# Altium project LPCXpresso55SXX.PrjPcb (part 2 of 2)

## Sheet CODEC.SchDoc
size A3; CheckedBy: José Ogando; Engineer: Eduardo Teofilo; Revision: A2; SheetNumber: 6; SheetTotal: 8
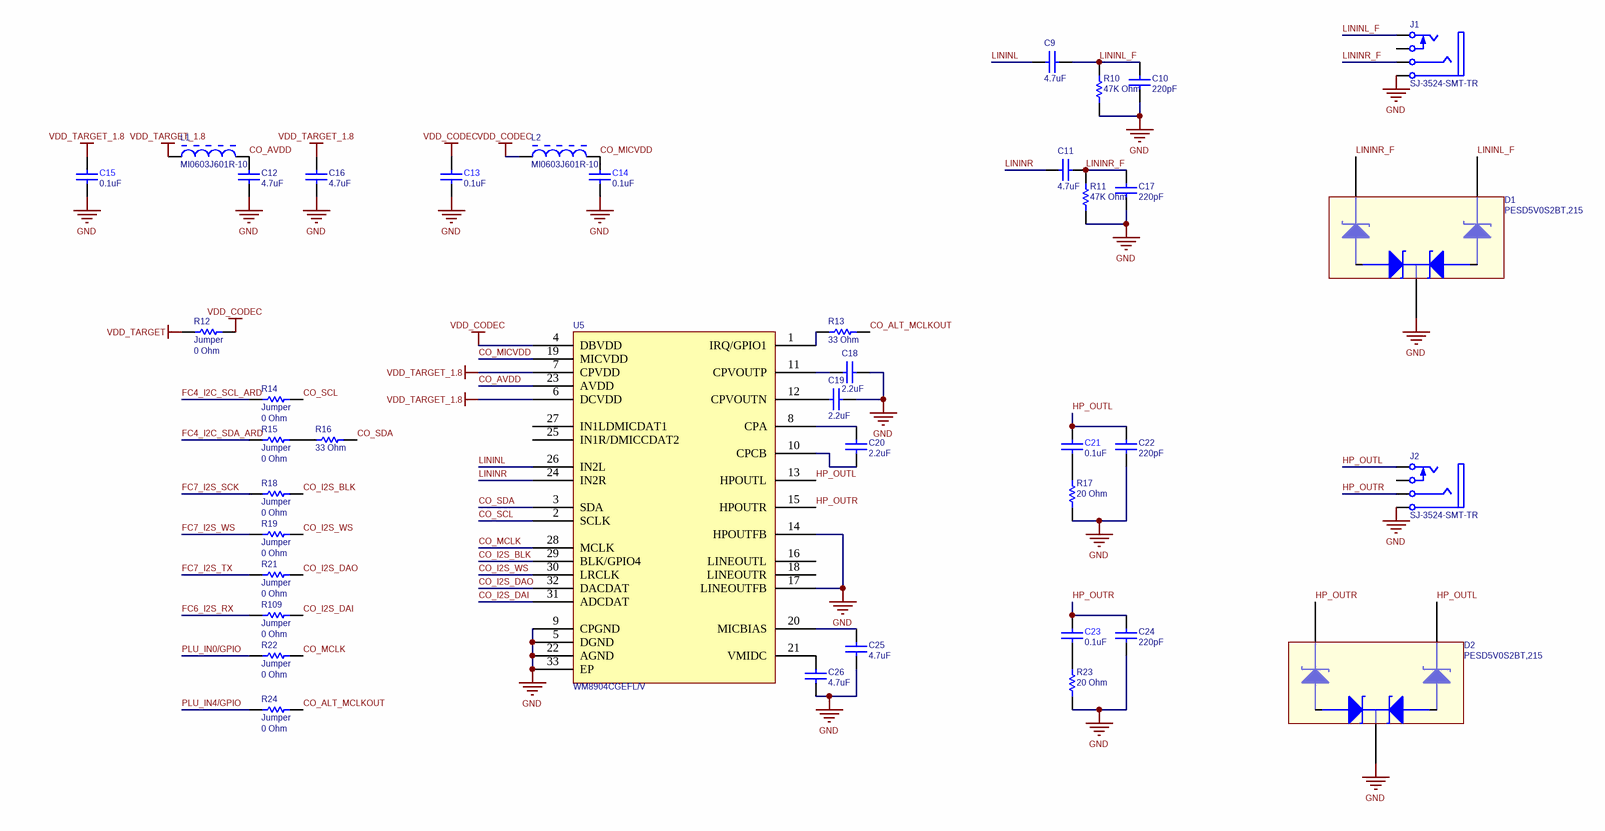
[diagram p5: CODEC.SchDoc]

### Parts
C9  value 4.7uF  [CAPC0603(1608)100_L]  (hidden comment: CAP 4.7uF 10V 0603(1608))
C10  value 220pF  [CAPC0402(1005)60_L]  (hidden comment: CAP 220pF 50V 0402(1005))
C11  value 4.7uF  [CAPC0603(1608)100_L]  (hidden comment: CAP 4.7uF 10V 0603(1608))
C12  value 4.7uF  [CAPC0603(1608)100_L]  (hidden comment: CAP 4.7uF 10V 0603(1608))
C13  value 0.1uF  [CAPC1005]  (hidden comment: CC0402KRX7R7BB104)
C14  value 0.1uF  [CAPC1005]  (hidden comment: CC0402KRX7R7BB104)
C15  value 0.1uF  [CAPC1005]  (hidden comment: CC0402KRX7R7BB104)
C16  value 4.7uF  [CAPC0603(1608)100_L]  (hidden comment: CAP 4.7uF 10V 0603(1608))
C17  value 220pF  [CAPC0402(1005)60_L]  (hidden comment: CAP 220pF 50V 0402(1005))
C18  value 2.2uF  [CAPC0402(1005)60_L]  (hidden comment: CAP 2.2uF 10V 0402(1005))
C19  value 2.2uF  [CAPC0402(1005)60_L]  (hidden comment: CAP 2.2uF 10V 0402(1005))
C20  value 2.2uF  [CAPC0402(1005)60_L]  (hidden comment: CAP 2.2uF 10V 0402(1005))
C21  value 0.1uF  [CAPC1005]  (hidden comment: CC0402KRX7R7BB104)
C22  value 220pF  [CAPC0402(1005)60_L]  (hidden comment: CAP 220pF 50V 0402(1005))
C23  value 0.1uF  [CAPC1005]  (hidden comment: CC0402KRX7R7BB104)
C24  value 220pF  [CAPC0402(1005)60_L]  (hidden comment: CAP 220pF 50V 0402(1005))
C25  value 4.7uF  [CAPC0603(1608)100_L]  (hidden comment: CAP 4.7uF 10V 0603(1608))
C26  value 4.7uF  [CAPC0603(1608)100_L]  (hidden comment: CAP 4.7uF 10V 0603(1608))
D1  PESD5V0S2BT,215  [SOT23-3]
D2  PESD5V0S2BT,215  [SOT23-3]
J1  SJ-3524-SMT-TR  [SJ-3524-SMT-TR]
J2  SJ-3524-SMT-TR  [SJ-3524-SMT-TR]
L1  MI0603J601R-10  [LIRD-MI0603J601R-10_V]
L2  MI0603J601R-10  [LIRD-MI0603J601R-10_V]
R10  value 47K Ohm  [RESC0402(1005)_L]  (hidden comment: 47K 1% 0402(1005))
R11  value 47K Ohm  [RESC0402(1005)_L]  (hidden comment: 47K 1% 0402(1005))
R12  Jumper  value 0 Ohm  [RESC0402(1005)_L]
R13  value 33 Ohm  [RESC0402(1005)_L]  (hidden comment: 33R 1% 0402(1005))
R14  Jumper  value 0 Ohm  [RESC0402(1005)_L]
R15  Jumper  value 0 Ohm  [RESC0402(1005)_L]
R16  value 33 Ohm  [RESC0402(1005)_L]  (hidden comment: 33R 1% 0402(1005))
R17  value 20 Ohm  [RESC0402(1005)_L]  (hidden comment: 20R 1% 0402(1005))
R18  Jumper  value 0 Ohm  [RESC0402(1005)_L]
R19  Jumper  value 0 Ohm  [RESC0402(1005)_L]
R21  Jumper  value 0 Ohm  [RESC0402(1005)_L]
R22  Jumper  value 0 Ohm  [RESC0402(1005)_L]
R23  value 20 Ohm  [RESC0402(1005)_L]  (hidden comment: 20R 1% 0402(1005))
R24  Jumper  value 0 Ohm  [RESC0402(1005)_L]
R109  Jumper  value 0 Ohm  [RESC0402(1005)_L]
U5  WM8904CGEFL/V  [QFN-32 4x4x0.75]

### Nets
GND: C10.1 C12.1 C13.2 C14.2 C15.2 C16.1 C17.1 C18.1 C19.1 C22.1 C24.1 C25.1 C26.1 D1.3(DK) D2.3(DK) J1.1(Sleeve) J2.1(Sleeve) R10.1 R11.1 R17.1 R23.1 U5.5(DGND) U5.9(CPGND) U5.14(HPOUTFB) U5.17(LINEOUTFB) U5.22(AGND) U5.33(EP)
VDD_CODEC: C13.1 L2.1 R12.1 U5.4(DBVDD)
VDD_TARGET: R12.2
VDD_TARGET_1.8: C15.1 C16.2 L1.1 U5.6(DCVDD) U5.7(CPVDD)
CO_ALT_MCLKOUT: R13.2 R24.1
CO_AVDD: C12.2 L1.2 U5.23(AVDD)
CO_I2S_BLK: R18.1 U5.29(BLK/GPIO4)
CO_I2S_DAI: R109.1 U5.31(ADCDAT)
CO_I2S_DAO: R21.1 U5.32(DACDAT)
CO_I2S_WS: R19.1 U5.30(LRCLK)
CO_MCLK: R22.1 U5.28(MCLK)
CO_MICVDD: C14.1 L2.2 U5.19(MICVDD)
CO_SCL: R14.1 U5.2(SCLK)
CO_SDA: R16.2 U5.3(SDA)
FC4_I2C_SCL_ARD: R14.2
FC4_I2C_SDA_ARD: R15.2
FC6_I2S_RX: R109.2
FC7_I2S_SCK: R18.2
FC7_I2S_TX: R21.2
FC7_I2S_WS: R19.2
HP_OUTL: C21.1 C22.2 D2.1(K1) J2.2(Tip) U5.13(HPOUTL)
HP_OUTR: C23.1 C24.2 D2.2(K2) J2.3(Ring) U5.15(HPOUTR)
LININL: C9.2 U5.26(IN2L)
LININL_F: C9.1 C10.2 D1.1(K1) J1.2(Tip) R10.2
LININR: C11.2 U5.24(IN2R)
LININR_F: C11.1 C17.2 D1.2(K2) J1.3(Ring) R11.2
PLU_IN0/GPIO: R22.2
PLU_IN4/GPIO: R24.2
NetC18_2: C18.2 U5.11(CPVOUTP)
NetC19_2: C19.2 U5.12(CPVOUTN)
NetC20_1: C20.1 U5.10(CPCB)
NetC20_2: C20.2 U5.8(CPA)
NetC21_2: C21.2 R17.2
NetC23_2: C23.2 R23.2
NetC25_2: C25.2 U5.20(MICBIAS)
NetC26_2: C26.2 U5.21(VMIDC)
NetR13_1: R13.1 U5.1(IRQ/GPIO1)
NetR15_1: R15.1 R16.1

Not connected (* = marked no-connect by the designer): J1 0 4(Tip_Switch); J2 0 4(Tip_Switch); U5 16(LINEOUTL) 18(LINEOUTR) 25(IN1R/DMICCDAT2) 27(IN1LDMICDAT1)

### Notes on the sheet
- Project:
- Sheet:
- Revision:
- Date:
- Size:
- Sheet number:
- Engineer
- Checked by:
- A3
- of
- www.code-ing.com

### Library data of the parts
C9 C11 C12 C16 C25 C26 = CMP-1035-02785-1: as C68 on sheet LPCXpresso55SXX_POWER-USB; Max Thickness: 1 mm; Technology: SMT; Rated Voltage: 10 V
C10 C17 C22 C24 = CMP-1034-01367-1: CAP 220pF 50V ±1% 0402 (1005 Metric) Thickness 0.6mm SMD; Tolerance: Â±1%; Case-EIA: 0402; Case-Metric: 1005; Max Thickness: 0.6 mm; Technology: SMT; Rated Voltage: 50 V
C13-C15 C21 C23 = CMP-0001-00074-1: as C71 on sheet LPCXpresso55SXX_POWER-USB; ClassName: Board Template Device; Rated Voltage: 16 V; Status: Production; Tolerance: 10 %; Mounting Technology: Surface Mount; Technology: Ceramic; Category: Capacitor; Dielectric: X7R; Publisher: Altium
C18-C20 = CMP-1034-02127-1: CAP 2.2uF 10V ±10% 0402 (1005 Metric) Thickness 0.6mm SMD; Case-EIA: 0402; Tolerance: Â±10%; Case-Metric: 1005; Technology: SMT; Rated Voltage: 10 V; Max Thickness: 0.6 mm
D1 D2 = PESD5V0S2BT,215: TVS DIODE 5V 14V SOT23; Manufacturer: Nexperia USA Inc.; Manufacturer part #: PESD5V0S2BT,215; Indications: *; Created by: eteofilo; Creation date: 17-Apr-2018; Value: *; Modified by: *
J1 J2 = SJ-3524-SMT-TR: CONN AUDIO JACK 3.5MM STEREO SMD; Manufacturer: CUI Inc; Manufacturer part#: SJ-3524-SMT-TR; Indications: *; Created by: gmoreno; Creation date: 23-May-2013; Modified by: *; Value: *
L1 L2 = CMP-2000-06700-1: as L8 on sheet LPCXpresso55SXX_POWER-USB; Datasheet Version: Rev. C, 08/2013; Ratings: -; Package Description: 2-Pin Surface Mount Device, Body 1.6 x 0.8 mm; Operating Temperature: -40°C~125°C; Category: Filters; Mounting Type: SurfaceMount; Size / Dimension: 0.063"Lx0.031"W(1.60mmx0.80mm); Family: FerriteBeadsandChips; Package Reference: MI00603J601R-10; Manufacturer URL: https://www.lairdtech.com/; Height (Max): 0.037"(0.95mm); Series: MI; Packaging: CutTape(CT); Mounting Technology: SurfaceMount; Package / Case: 0603(1608Metric); Standard Package: 1; Datasheet URL: http://cdn.lairdtech.com/home/brandworld/files/MI0603J601R-10.pdf
R10 R11 = CMP-1011-00699-1: 47K 0.063W 1% 0402 (1005 Metric)  SMD; Case-EIA: 0402; Case-Metric: 1005; Power: 0.063 W; Technology: SMT; Tolerance: 1 %
R12 R14 R15 R18 R19 R21 R22 R24 R109 = CMP-1011-00001-1: as R97 on sheet SHIELD-uSD-MIKROE-PMOD; Power: None; Technology: SMT
R13 R16 = CMP-1011-00341-1: 33R 0.063W 1% 0402 (1005 Metric)  SMD; Case-Metric: 1005; Case-EIA: 0402; Tolerance: 1 %; Power: 0.063 W; Technology: SMT
R17 R23 = CMP-1011-00316-1: 20R 0.063W 1% 0402 (1005 Metric)  SMD; Case-EIA: 0402; Case-Metric: 1005; Power: 0.063 W; Tolerance: 1 %; Technology: SMT
U5 = WM8904CGEFL/V: IC CODEC STEREO ULP 32QFN; Manufacturer: Cirrus Logic Inc.; Manufacturer part #: WM8904CGEFL/V; Indications: *; Created by: eteofilo; Creation date: 17-Apr-2018; Modified by: *; Value: *

## Sheet LINK2_LPC4322 PERIPH-DEBUG.SchDoc
size A3; CheckedBy: José Ogando; Engineer: Eduardo Teofilo; Revision: A2; SheetNumber: 8; SheetTotal: 8
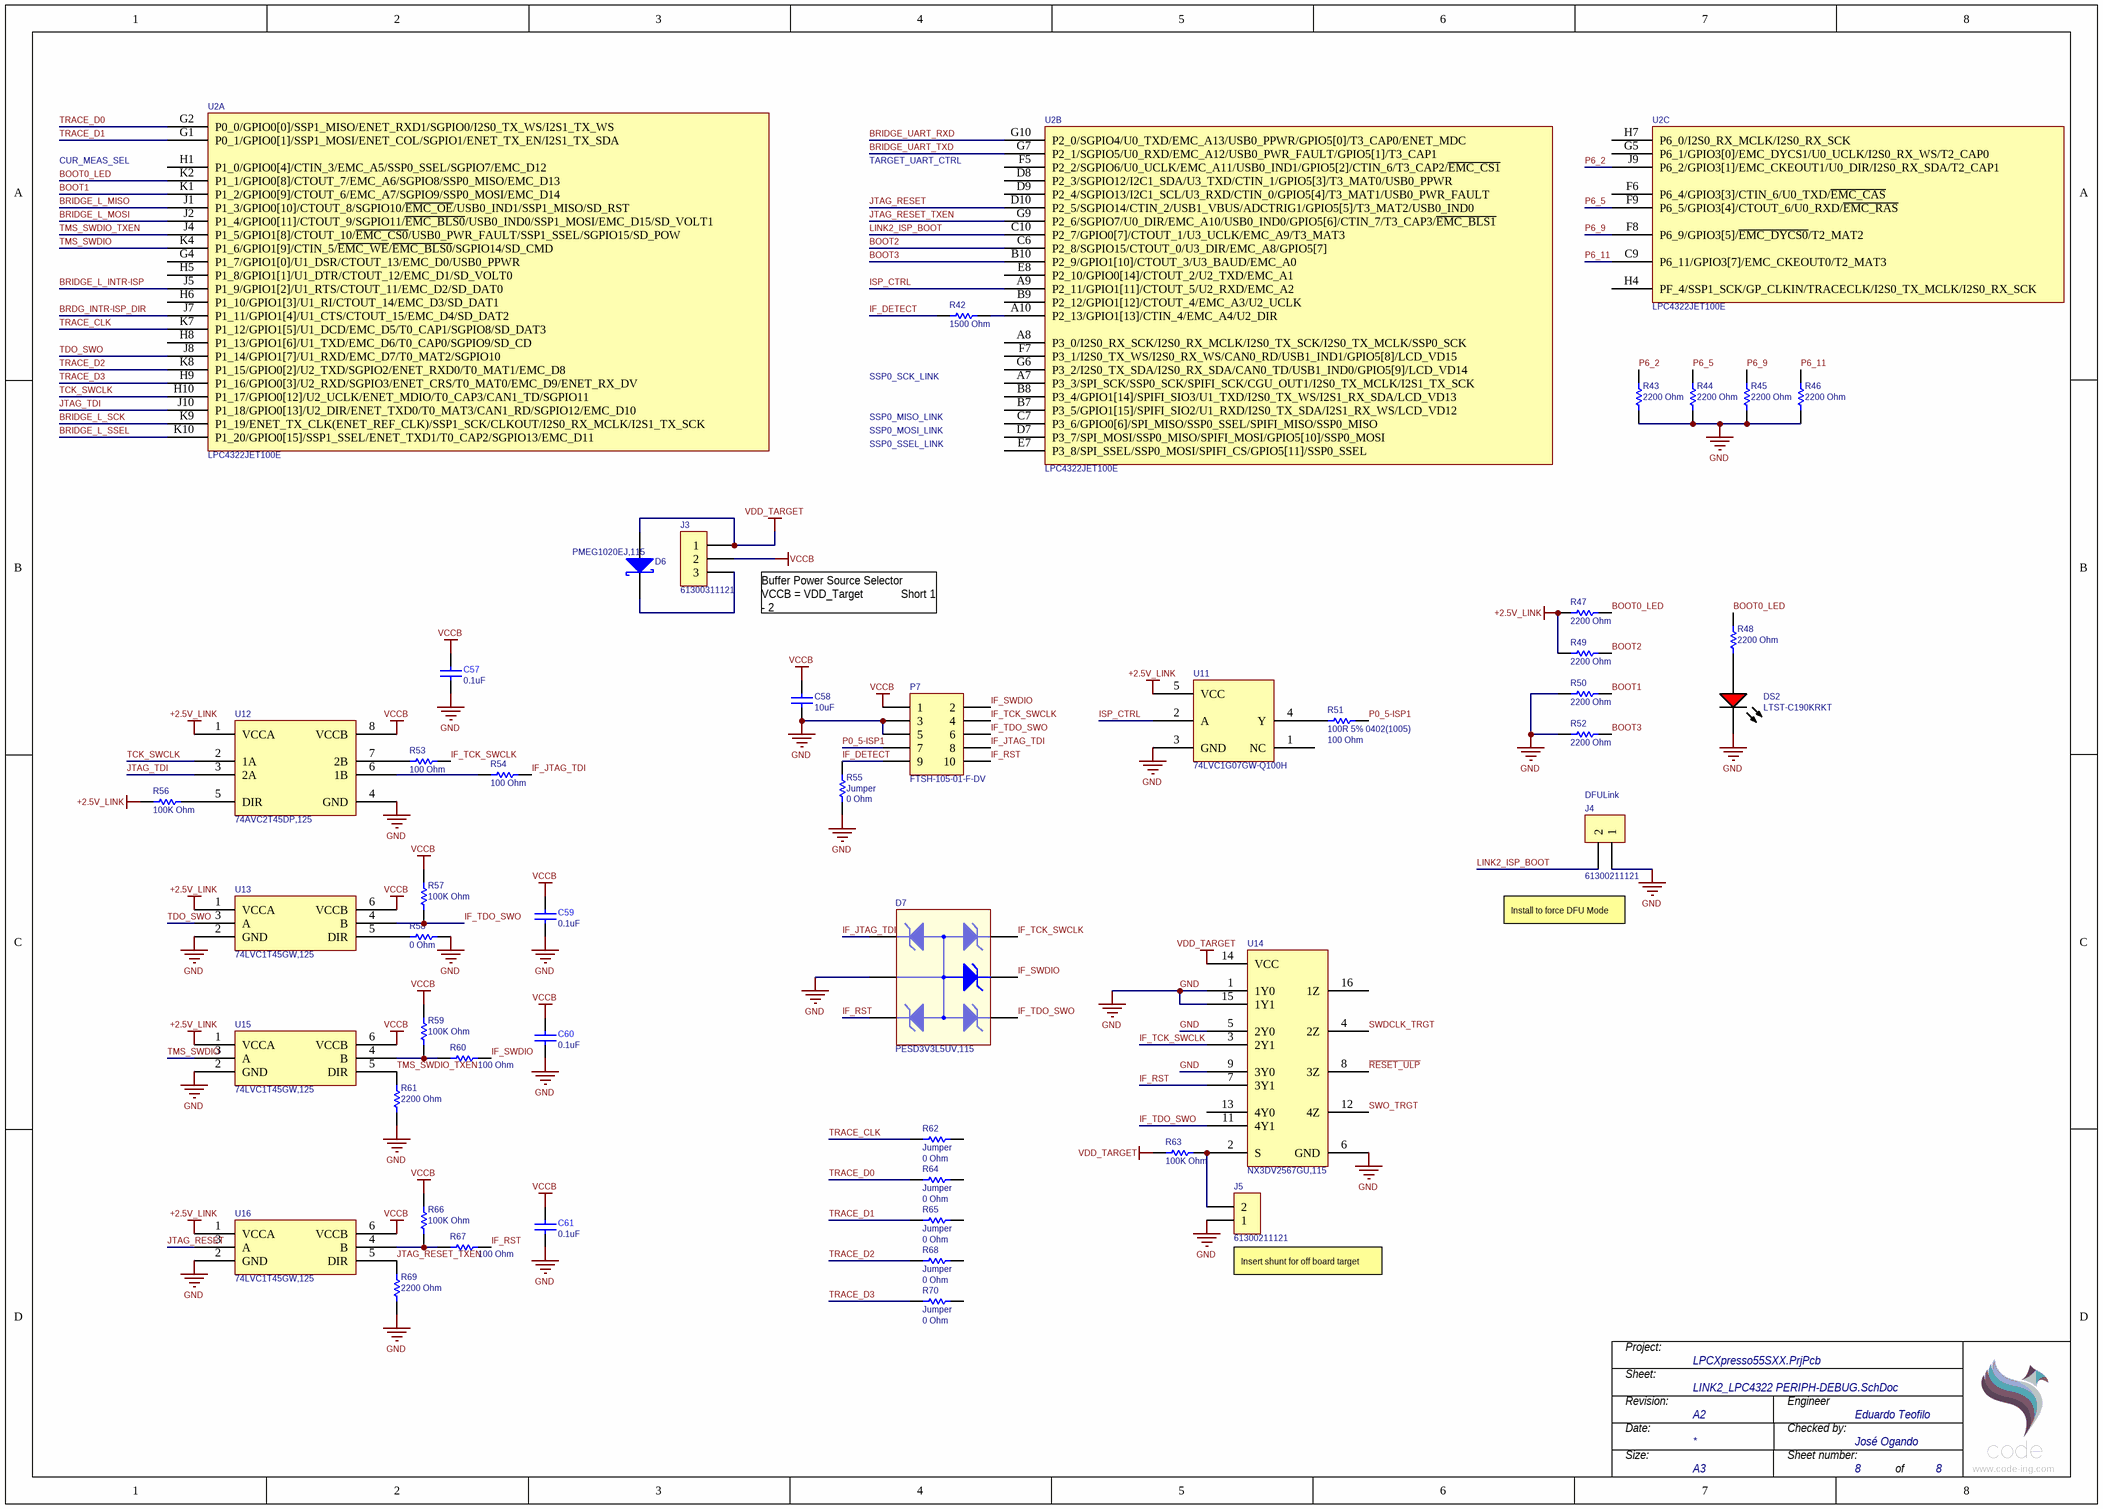
[diagram p6: LINK2_LPC4322 PERIPH-DEBUG.SchDoc]

### Parts
C57  value 0.1uF  [CAPC1005]  (hidden comment: CC0402KRX7R7BB104)
C58  value 10uF  [CAPC0805(2012)145_L]  (hidden comment: CAP 10uF 10V 0805(2012))
C59  value 0.1uF  [CAPC1005]  (hidden comment: CC0402KRX7R7BB104)
C60  value 0.1uF  [CAPC1005]  (hidden comment: CC0402KRX7R7BB104)
C61  value 0.1uF  [CAPC1005]  (hidden comment: CC0402KRX7R7BB104)
D6  PMEG1020EJ,115  [SOD-323F, SC90]
D7  PESD3V3L5UV,115  [SOT-666]
DS2  LTST-C190KRKT  [LTST-C191KRKT_V]
J3  61300311121  [61300311121]
J4  61300211121  [61300211121]
J5  61300211121  [61300211121]
P7  FTSH-105-01-F-DV  [FTSH-105-01-L-DV-K]
R42  value 1500 Ohm  [RESC0402(1005)_L]  (hidden comment: 1K5 1% 0402(1005))
R43  value 2200 Ohm  [RESC0402(1005)_L]  (hidden comment: 2K2 1% 0402(1005))
R44  value 2200 Ohm  [RESC0402(1005)_L]  (hidden comment: 2K2 1% 0402(1005))
R45  value 2200 Ohm  [RESC0402(1005)_L]  (hidden comment: 2K2 1% 0402(1005))
R46  value 2200 Ohm  [RESC0402(1005)_L]  (hidden comment: 2K2 1% 0402(1005))
R47  value 2200 Ohm  [RESC0402(1005)_L]  (hidden comment: 2K2 1% 0402(1005))
R48  value 2200 Ohm  [RESC0402(1005)_L]  (hidden comment: 2K2 1% 0402(1005))
R49  value 2200 Ohm  [RESC0402(1005)_L]  (hidden comment: 2K2 1% 0402(1005))
R50  value 2200 Ohm  [RESC0402(1005)_L]  (hidden comment: 2K2 1% 0402(1005))
R51  100R 5% 0402(1005)  value 100 Ohm  [RESC0402(1005)_L]
R52  value 2200 Ohm  [RESC0402(1005)_L]  (hidden comment: 2K2 1% 0402(1005))
R53  value 100 Ohm  [RESC0402(1005)_L]  (hidden comment: 100R 5% 0402(1005))
R54  value 100 Ohm  [RESC0402(1005)_L]  (hidden comment: 100R 5% 0402(1005))
R55  Jumper  value 0 Ohm  [RESC0402(1005)_L]
R56  value 100K Ohm  [RESC1005X40X25LL05T05]  (hidden comment: ERJ-2RKF1003X)
R57  value 100K Ohm  [RESC1005X40X25LL05T05]  (hidden comment: ERJ-2RKF1003X)
R58  value 0 Ohm  [RESC0402(1005)_L]  (hidden comment: Jumper 0402(1005))
R59  value 100K Ohm  [RESC1005X40X25LL05T05]  (hidden comment: ERJ-2RKF1003X)
R60  value 100 Ohm  [RESC0402(1005)_L]  (hidden comment: 100R 5% 0402(1005))
R61  value 2200 Ohm  [RESC0402(1005)_L]  (hidden comment: 2K2 1% 0402(1005))
R62  Jumper  value 0 Ohm  [RESC0402(1005)_L]
R63  value 100K Ohm  [RESC1005X40X25LL05T05]  (hidden comment: ERJ-2RKF1003X)
R64  Jumper  value 0 Ohm  [RESC0402(1005)_L]
R65  Jumper  value 0 Ohm  [RESC0402(1005)_L]
R66  value 100K Ohm  [RESC1005X40X25LL05T05]  (hidden comment: ERJ-2RKF1003X)
R67  value 100 Ohm  [RESC0402(1005)_L]  (hidden comment: 100R 5% 0402(1005))
R68  Jumper  value 0 Ohm  [RESC0402(1005)_L]
R69  value 2200 Ohm  [RESC0402(1005)_L]  (hidden comment: 2K2 1% 0402(1005))
R70  Jumper  value 0 Ohm  [RESC0402(1005)_L]
U2  LPC4322JET100E  [BGA100_9x9x1.2mm]  (parts A,B,C of 5)
U11  74LVC1G07GW-Q100H  [SOT353]
U12  74AVC2T45DP,125  [TSSOP8]
U13  74LVC1T45GW,125  [SOT-363]
U14  NX3DV2567GU,115  [XQFN16]
U15  74LVC1T45GW,125  [SOT-363]
U16  74LVC1T45GW,125  [SOT-363]

### Nets
+2.5V_LINK: R47.2 R49.2 R56.1 U11.5(VCC) U12.1(VCCA) U13.1(VCCA) U15.1(VCCA) U16.1(VCCA)
GND: C57.2 C58.1 C59.2 C60.2 C61.2 D7.2(GND) DS2.2(K) J4.1 J5.1 P7.3 P7.5 R43.1 R44.1 R45.1 R46.1 R50.2 R52.2 R55.1 R58.1 R61.1 R69.1 U11.3(GND) U12.4(GND) U13.2(GND) U14.1(1Y0) U14.5(2Y0) U14.6(GND) U14.9(3Y0) U14.15(1Y1) U15.2(GND) U16.2(GND)
VCCB: C57.1 C58.2 C59.1 C60.1 C61.1 J3.2 P7.1 R57.2 R59.2 R66.2 U12.8(VCCB) U13.6(VCCB) U15.6(VCCB) U16.6(VCCB)
VDD_TARGET: D6.2(A) J3.1 R63.2 U14.14(VCC)
BOOT0_LED: R47.1 R48.2 U2.K2(P1_1/GPIO0[8]/CTOUT_7/EMC_A6/SGPIO8/SSP0_MISO/EMC_D13)
BOOT1: R50.1 U2.K1(P1_2/GPIO0[9]/CTOUT_6/EMC_A7/SGPIO9/SSP0_MOSI/EMC_D14)
BOOT2: R49.1 U2.C6(P2_8/SGPIO15/CTOUT_0/U3_DIR/EMC_A8/GPIO5[7])
BOOT3: R52.1 U2.B10(P2_9/GPIO1[10]/CTOUT_3/U3_BAUD/EMC_A0)
BRDG_INTR-ISP_DIR: U2.J7(P1_11/GPIO1[4]/U1_CTS/CTOUT_15/EMC_D4/SD_DAT2)
BRIDGE_L_INTR-ISP: U2.J5(P1_9/GPIO1[2]/U1_RTS/CTOUT_11/EMC_D2/SD_DAT0)
BRIDGE_L_MISO: U2.J1(P1_3/GPIO0[10]/CTOUT_8/SGPIO10/~{EMC_OE}/USB0_IND1/SSP1_MISO/SD_RST)
BRIDGE_L_MOSI: U2.J2(P1_4/GPIO0[11]/CTOUT_9/SGPIO11/~{EMC_BLS0}/USB0_IND0/SSP1_MOSI/EMC_D15/SD_VOLT1)
BRIDGE_L_SCK: U2.K9(P1_19/ENET_TX_CLK(ENET_REF_CLK)/SSP1_SCK/CLKOUT/I2S0_RX_MCLK/I2S1_TX_SCK)
BRIDGE_L_SSEL: U2.K10(P1_20/GPIO0[15]/SSP1_SSEL/ENET_TXD1/T0_CAP2/SGPIO13/EMC_D11)
BRIDGE_UART_RXD: U2.G10(P2_0/SGPIO4/U0_TXD/EMC_A13/USB0_PPWR/GPIO5[0]/T3_CAP0/ENET_MDC)
BRIDGE_UART_TXD: U2.G7(P2_1/SGPIO5/U0_RXD/EMC_A12/USB0_PWR_FAULT/GPIO5[1]/T3_CAP1)
IF_DETECT: P7.9 R42.1 R55.2
IF_JTAG_TDI: D7.1(I/O1) P7.8 R54.2
IF_RST: D7.3(I/O2) P7.10 R67.2 U14.7(3Y1)
IF_SWDIO: D7.5(I/O4) P7.2 R60.2
IF_TCK_SWCLK: D7.6(I/O5) P7.4 R53.2 U14.3(2Y1)
IF_TDO_SWO: D7.4(I/O3) P7.6 R57.1 U13.4(B) U14.11(4Y1)
ISP_CTRL: U2.A9(P2_11/GPIO1[11]/CTOUT_5/U2_RXD/EMC_A2) U11.2(A)
JTAG_RESET: U2.D10(P2_5/SGPIO14/CTIN_2/USB1_VBUS/ADCTRIG1/GPIO5[5]/T3_MAT2/USB0_IND0) U16.3(A)
JTAG_RESET_TXEN: R69.2 U2.G9(P2_6/SGPIO7/U0_DIR/EMC_A10/USB0_IND0/GPIO5[6]/CTIN_7/T3_CAP3/~{EMC_BLS1}) U16.5(DIR)
JTAG_TDI: U2.J10(P1_18/GPIO0[13]/U2_DIR/ENET_TXD0/T0_MAT3/CAN1_RD/SGPIO12/EMC_D10) U12.3(2A)
LINK2_ISP_BOOT: J4.2 U2.C10(P2_7/GPIO0[7]/CTOUT_1/U3_UCLK/EMC_A9/T3_MAT3)
P0_5-ISP1: P7.7 R51.2
P6_2: R43.2 U2.J9(P6_2/GPIO3[1]/EMC_CKEOUT1/U0_DIR/I2S0_RX_SDA/T2_CAP1)
P6_5: R44.2 U2.F9(P6_5/GPIO3[4]/CTOUT_6/U0_RXD/~{EMC_RAS})
P6_9: R45.2 U2.F8(P6_9/GPIO3[5]/~{EMC_DYCS0}/T2_MAT2)
P6_11: R46.2 U2.C9(P6_11/GPIO3[7]/EMC_CKEOUT0/T2_MAT3)
~{RESET_ULP}: U14.8(3Z)
SWDCLK_TRGT: U14.4(2Z)
SWO_TRGT: U14.12(4Z)
TCK_SWCLK: U2.H10(P1_17/GPIO0[12]/U2_UCLK/ENET_MDIO/T0_CAP3/CAN1_TD/SGPIO11) U12.2(1A)
TDO_SWO: U2.J8(P1_14/GPIO1[7]/U1_RXD/EMC_D7/T0_MAT2/SGPIO10) U13.3(A)
TMS_SWDIO: U2.K4(P1_6/GPIO1[9]/CTIN_5/~{EMC_WE}/~{EMC_BLS0}/SGPIO14/SD_CMD) U15.3(A)
TMS_SWDIO_TXEN: R61.2 U2.J4(P1_5/GPIO1[8]/CTOUT_10/~{EMC_CS0}/USB0_PWR_FAULT/SSP1_SSEL/SGPIO15/SD_POW) U15.5(DIR)
TRACE_CLK: R62.1 U2.K7(P1_12/GPIO1[5]/U1_DCD/EMC_D5/T0_CAP1/SGPIO8/SD_DAT3)
TRACE_D0: R64.1 U2.G2(P0_0/GPIO0[0]/SSP1_MISO/ENET_RXD1/SGPIO0/I2S0_TX_WS/I2S1_TX_WS)
TRACE_D1: R65.1 U2.G1(P0_1/GPIO0[1]/SSP1_MOSI/ENET_COL/SGPIO1/ENET_TX_EN/I2S1_TX_SDA)
TRACE_D2: R68.1 U2.K8(P1_15/GPIO0[2]/U2_TXD/SGPIO2/ENET_RXD0/T0_MAT1/EMC_D8)
TRACE_D3: R70.1 U2.H9(P1_16/GPIO0[3]/U2_RXD/SGPIO3/ENET_CRS/T0_MAT0/EMC_D9/ENET_RX_DV)
NetD6_1: D6.1(K) J3.3
NetDS2_1: DS2.1(A) R48.1
NetJ5_2: J5.2 R63.1 U14.2(S)
NetR42_2: R42.2 U2.A10(P2_13/GPIO1[13]/CTIN_4/EMC_A4/U2_DIR)
NetR51_1: R51.1 U11.4(Y)
NetR53_1: R53.1 U12.7(2B)
NetR54_1: R54.1 U12.6(1B)
NetR56_2: R56.2 U12.5(DIR)
NetR58_2: R58.2 U13.5(DIR)
NetR59_1: R59.1 R60.1 U15.4(B)
NetR66_1: R66.1 R67.1 U16.4(B)

Not connected (* = marked no-connect by the designer): R62 2; R64 2; R65 2; R68 2; R70 2; U2 A7(P3_3/SPI_SCK/SSP0_SCK/SPIFI_SCK/CGU_OUT1/I2S0_TX_MCLK/I2S1_TX_SCK) A8(P3_0/I2S0_RX_SCK/I2S0_RX_MCLK/I2S0_TX_SCK/I2S0_TX_MCLK/SSP0_SCK) B7(P3_5/GPIO1[15]/SPIFI_SIO2/U1_RXD/I2S0_TX_SDA/I2S1_RX_WS/LCD_VD12) B8(P3_4/GPIO1[14]/SPIFI_SIO3/U1_TXD/I2S0_TX_WS/I2S1_RX_SDA/LCD_VD13) B9(P2_12/GPIO1[12]/CTOUT_4/EMC_A3/U2_UCLK) C7(P3_6/GPIO0[6]/SPI_MISO/SSP0_SSEL/SPIFI_MISO/SSP0_MISO) D7(P3_7/SPI_MOSI/SSP0_MISO/SPIFI_MOSI/GPIO5[10]/SSP0_MOSI) D8(P2_3/SGPIO12/I2C1_SDA/U3_TXD/CTIN_1/GPIO5[3]/T3_MAT0/USB0_PPWR) D9(P2_4/SGPIO13/I2C1_SCL/U3_RXD/CTIN_0/GPIO5[4]/T3_MAT1/USB0_PWR_FAULT) E7(P3_8/SPI_SSEL/SSP0_MOSI/SPIFI_CS/GPIO5[11]/SSP0_SSEL) E8(P2_10/GPIO0[14]/CTOUT_2/U2_TXD/EMC_A1) F5(P2_2/SGPIO6/U0_UCLK/EMC_A11/USB0_IND1/GPIO5[2]/CTIN_6/T3_CAP2/~{EMC_CS1}) F6(P6_4/GPIO3[3]/CTIN_6/U0_TXD/~{EMC_CAS}) F7(P3_1/I2S0_TX_WS/I2S0_RX_WS/CAN0_RD/USB1_IND1/GPIO5[8]/LCD_VD15) G4(P1_7/GPIO1[0]/U1_DSR/CTOUT_13/EMC_D0/USB0_PPWR) G5(P6_1/GPIO3[0]/EMC_DYCS1/U0_UCLK/I2S0_RX_WS/T2_CAP0) G6(P3_2/I2S0_TX_SDA/I2S0_RX_SDA/CAN0_TD/USB1_IND0/GPIO5[9]/LCD_VD14) H1(P1_0/GPIO0[4]/CTIN_3/EMC_A5/SSP0_SSEL/SGPIO7/EMC_D12) H4(PF_4/SSP1_SCK/GP_CLKIN/TRACECLK/I2S0_TX_MCLK/I2S0_RX_SCK) H5(P1_8/GPIO1[1]/U1_DTR/CTOUT_12/EMC_D1/SD_VOLT0) H6(P1_10/GPIO1[3]/U1_RI/CTOUT_14/EMC_D3/SD_DAT1) H7(P6_0/I2S0_RX_MCLK/I2S0_RX_SCK) H8(P1_13/GPIO1[6]/U1_TXD/EMC_D6/T0_CAP0/SGPIO9/SD_CD); U11 1(NC); U14 10(NC) 13(4Y0) 16(1Z)

### Notes on the sheet
- CUR_MEAS_SEL
- TARGET_UART_CTRL
- SSP0_SCK_LINK
- SSP0_MISO_LINK
- SSP0_MOSI_LINK
- SSP0_SSEL_LINK
- Buffer Power Source Selector
  VCCB = VDD_Target            Short 1 - 2
  VCCB = Off-board Target   Short 2 - 3
- DFULink
- Install to force DFU Mode
- (near J5) Insert shunt for off board target
- Project:
- Sheet:
- Revision:
- Date:
- Size:
- Sheet number:
- Engineer
- Checked by:
- A3
- of
- www.code-ing.com

### Library data of the parts
C57 C59-C61 = CMP-0001-00074-1: as C71 on sheet LPCXpresso55SXX_POWER-USB; ClassName: Board Template Device; Rated Voltage: 16 V; Status: Production; Tolerance: 10 %; Mounting Technology: Surface Mount; Technology: Ceramic; Category: Capacitor; Dielectric: X7R; Publisher: Altium
C58 = CMP-1036-04922-1: CAP 10uF 10V ±10% 0805 (2012 Metric) Thickness 1.45mm SMD; Tolerance: Â±10%; Case-EIA: 0805; Case-Metric: 2012; Technology: SMT; Rated Voltage: 10 V; Max Thickness: 1.45 mm
D6 = PMEG1020EJ,115: DIODE SCHOTTKY 10V 2A SOD323F; Manufacturer: Nexperia USA Inc.; Manufacturer part #: PMEG1020EJ,115; Created by: eteofilo; Creation Date: 12-Apr-2018; Modified by: *; Value: *; Indications: *
D7 = PESD3V3L5UV,115: TVS DIODE 3.3V 12V SOT666; Manufacturer: Nexperia USA Inc.; Manufacturer part #: PESD3V3L5UV,115; Indications: *; Modified by: *; Created by: eteofilo; Creation date: 12-Apr-2018; Value: *
DS2 = CMP-1674-00011-1: LED Uni-Color Red, 62.5 mW, 5 V, -30 to 85 degC, 2-Pin SMD, RoHS, Tape and Reel; Capacitance: 100 uF; Voltage Rating: 50 V; Case\Package: Radial; Tolerance: 20%; Packaging: Bulk; REACH SVHC: No SVHC; ComponentLink1Description: Manufacturer URL; ComponentLink2URL: http://optoelectronics.liteon.com/upload/download/DS-22-99-0151/S_110_LTST-C190KRKT.pdf; Max Operating Temperature: 85 degC; DatasheetVersion: Rev. F, 05/2013; Pins: 2; Voltage Rating (DC): 50 V; Mount: Through Hole; Lead Pitch: 3.5 mm; Diameter: 8 mm; ComponentLink1URL: http://www.us.liteon.com/; Radiation Hardening: No; Package Quantity: 200; PackageReference: C191KRKT; RoHSCompliant: true; Height: 11.5 mm; PackageDescription: 2-Pin Surface Mount Device, Body 1.6 x 0.8 mm; Length: 11.5 mm; ComponentLink2Description: Datasheet; Min Operating Temperature: -40 degC
J3 = 61300311121: as J6 on sheet LPCXpresso55SXX_POWER-USB; Manufacturer part #: 61300311121; DigiKey: *; Modified by: *; Value: *; Created by: gmoreno; Creation date: 28-Jul-2012
J4 = 61300211121: as J7 on sheet LPCXpresso55SXX_POWER-USB; Manufacturer part #: 61300211121; Modified by: *; Value: *; Created by: gmoreno; Creation date: 28-Jul-2012
J5 = 61300211121: as J11 on sheet LPCXpresso55SXX_POWER-USB; Manufacturer part #: 61300211121; Modified by: *; Value: *; Created by: gmoreno; Creation date: 28-Jul-2012
P7 = FTSH-105-01-F-DV: CONN HEADER 10POS DUAL .05" SMD; Manufacturer: Samtec Inc; Manufacturer part #: FTSH-105-01-F-DV; Indications: *; Created by: gmoreno; Creation date: 29-Jul-2013; Value: *; Modified by: *
R42 = CMP-1011-00528-1: 1K5 0.063W 1% 0402 (1005 Metric)  SMD; Case-Metric: 1005; Case-EIA: 0402; Tolerance: 1 %; Power: 0.063 W; Technology: SMT
R43-R45 = CMP-1011-00546-1: 2K2 0.063W 1% 0402 (1005 Metric)  SMD; Case-Metric: 1005; Case-EIA: 0402; Indications: DNI; Power: 0.063 W; Tolerance: 1 %; Technology: SMT
R46-R50 R52 R61 R69 = CMP-1011-00546-1: as R71 on sheet LPCXpresso55SXX_MCU; Power: 0.063 W; Tolerance: 1 %; Technology: SMT
R51 R53 R54 R60 R67 = CMP-1011-00050-1: 100R 0.063W 5% 0402 (1005 Metric)  SMD; Case-Metric: 1005; Case-EIA: 0402; Power: 0.063 W; Technology: SMT; Tolerance: 5 %
R55 R58 = CMP-1011-00001-1: as R97 on sheet SHIELD-uSD-MIKROE-PMOD; Power: None; Technology: SMT
R56 R57 R59 R63 R66 = CMP-2002-00608-3: as R88 on sheet LPCXpresso55SXX_POWER-USB; Case Code (Imperial): 0402; RoHSCompliant: true; Min Operating Temperature: -55 degC; Mount: Surface Mount; Packaging: Tape and Reel; PackageDescription: 2-Pin Surface Mount Device, Body 1 x 0.5 mm; Tolerance: 1%; REACH SVHC: Yes; ComponentLink1URL: http://www.panasonic.com/; ComponentLink1Description: Manufacturer URL; Package Quantity: 10000; Mounting Technology: Surface Mount; DatasheetVersion: 04/2015; PartNumber: ERJ-2RKF1003X; Height: 0.35 mm; Pins: 2; Length: 1 mm; Max Operating Temperature: 155 degC; ComponentLink2Description: Datasheet; ComponentLink2URL: http://industrial.panasonic.com/cdbs/www-data/pdf/RDA0000/AOA0000C86.pdf; PackageReference: 0402; Radiation Hardening: No; Width: 0.5 mm; Case Code (Metric): 1005
R62 R64 R65 R68 R70 = CMP-1011-00001-1: Jumper 0402 (1005 Metric); Tolerance: None; Case-Metric: 1005; Case-EIA: 0402; Indications: DNI; Power: None; Technology: SMT
U2 = LPC4322JET100E: IC MCU 32BIT 512KB FLASH 100BGA; Manufacturer: NXP; Manufacturer Part #: LPC4322JET100E; Created by: eteofilo; Creation Date: 09-Apr-2018; Modified by: *; Indications: *; Value: *
U11 = 74LVC1G07GW-Q100H: IC BUFF OPEN DRAIN N-INV 5TSSOP; Manufacturer: Nexperia USA Inc.; Manufacturer part #: 74LVC1G07GW-Q100H; Indications: *; Modified by: *; Created by: eteofilo; Creation date: 12-Apr-2018; Value: *
U12 = 74AVC2T45DP,125: IC BUS TRANSCVR TRI-ST DL 8TSSOP; Manufacturer: Nexperia USA Inc.; Created By: eteofilo; Creation Date: 11-Apr-2018; Modified by: *; Indications: *; Value: *; Manufacturer Part #: 74AVC2T45DP,125
U13 U15 U16 = 74LVC1T45GW,125: TXRX XLATING DUAL 3ST 6TSSOP; Manufacturer: Nexperia USA Inc.; Created By: eteofilo; Creation Date: 12-Apr-2018; Modified by: *; Indications: *; Value: *; Manufacturer Part #: 74LVC1T45GW,125
U14 = NX3DV2567GU,115: IC ANLG SWITCH 4PDT 16XQFN; Manufacturer: NXP USA Inc.; Manufacturer part #: NX3DV2567GU,115; Indications: *; Modified by: *; Creation date: 14-Apr-2018; Created by: eteofilo; Value: *

## Sheet LINK2_LPC4322-USB-BRPWR.SchDoc
size A3; CheckedBy: José Ogando; Engineer: Eduardo Teofilo; Revision: A2; SheetNumber: 7; SheetTotal: 8
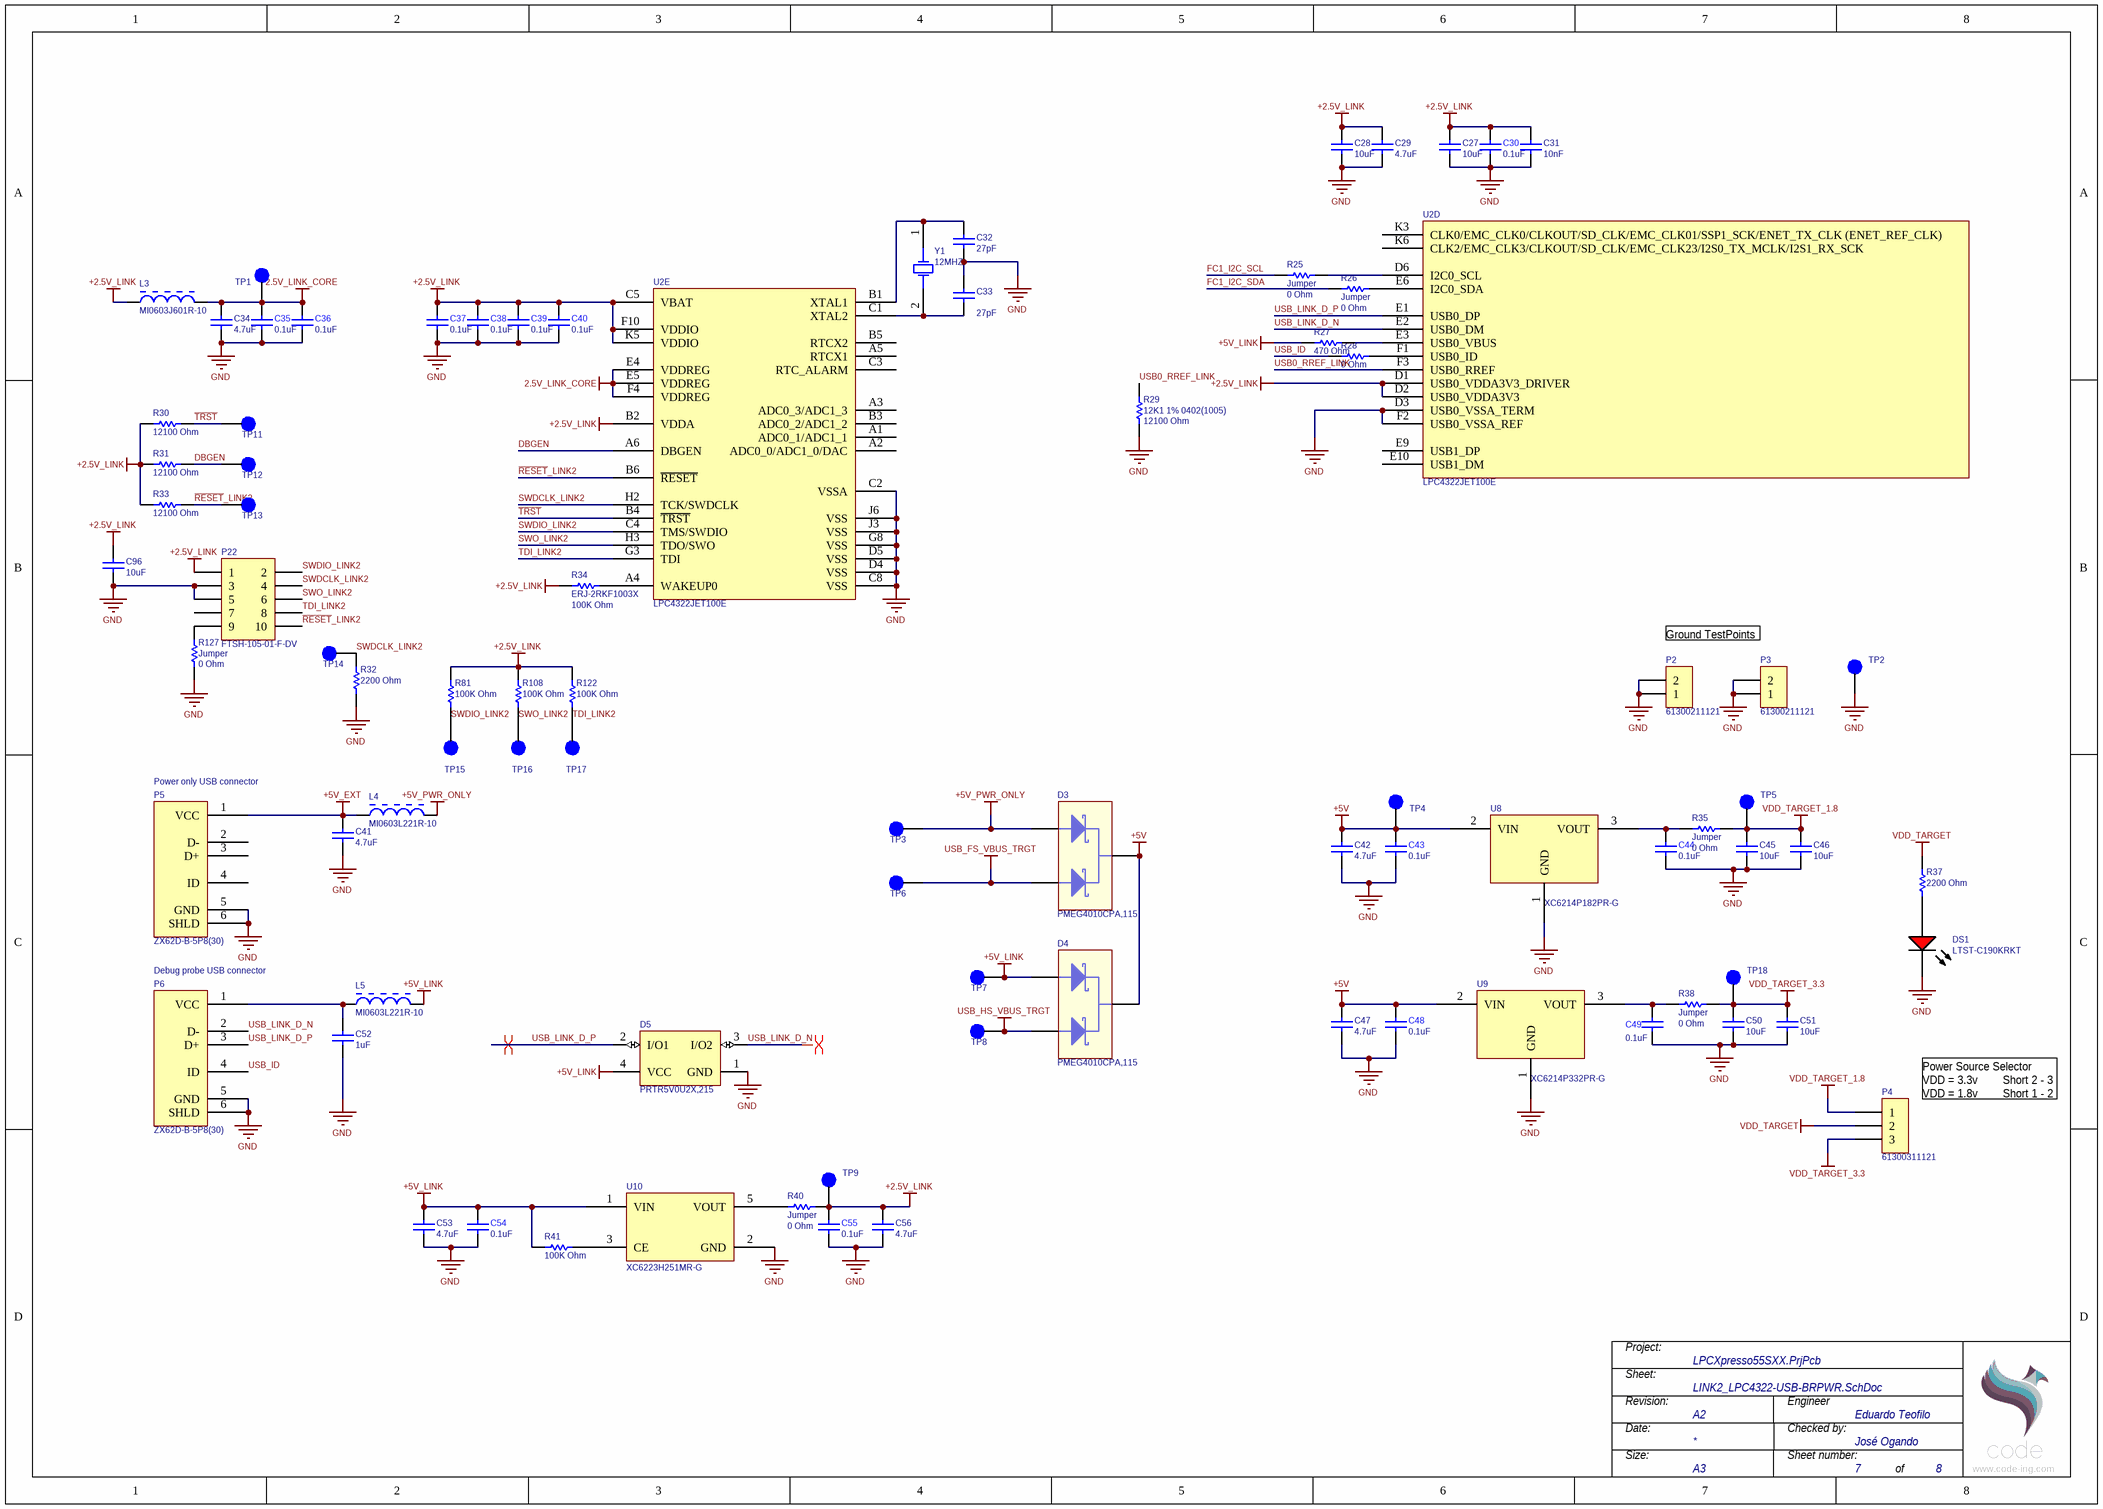
[diagram p7: LINK2_LPC4322-USB-BRPWR.SchDoc]

### Parts
C27  value 10uF  [CAPC0805(2012)145_L]  (hidden comment: CAP 10uF 10V 0805(2012))
C28  value 10uF  [CAPC0805(2012)145_L]  (hidden comment: CAP 10uF 10V 0805(2012))
C29  value 4.7uF  [CAPC0603(1608)100_L]  (hidden comment: CAP 4.7uF 10V 0603(1608))
C30  value 0.1uF  [CAPC1005]  (hidden comment: CC0402KRX7R7BB104)
C31  value 10nF  [CAPC0402(1005)60_L]  (hidden comment: CAP 10nF 25V 0402(1005))
C32  value 27pF  [CAPC0402(1005)60_L]  (hidden comment: CAP 27pF 50V 0402(1005))
C33  value 27pF  [CAPC0402(1005)60_L]  (hidden comment: CAP 27pF 50V 0402(1005))
C34  value 4.7uF  [CAPC0603(1608)100_L]  (hidden comment: CAP 4.7uF 10V 0603(1608))
C35  value 0.1uF  [CAPC1005]  (hidden comment: CC0402KRX7R7BB104)
C36  value 0.1uF  [CAPC1005]  (hidden comment: CC0402KRX7R7BB104)
C37  value 0.1uF  [CAPC1005]  (hidden comment: CC0402KRX7R7BB104)
C38  value 0.1uF  [CAPC1005]  (hidden comment: CC0402KRX7R7BB104)
C39  value 0.1uF  [CAPC1005]  (hidden comment: CC0402KRX7R7BB104)
C40  value 0.1uF  [CAPC1005]  (hidden comment: CC0402KRX7R7BB104)
C41  value 4.7uF  [CAPC0603(1608)100_L]  (hidden comment: CAP 4.7uF 10V 0603(1608))
C42  value 4.7uF  [CAPC0603(1608)100_L]  (hidden comment: CAP 4.7uF 10V 0603(1608))
C43  value 0.1uF  [CAPC1005]  (hidden comment: CC0402KRX7R7BB104)
C44  value 0.1uF  [CAPC1005]  (hidden comment: CC0402KRX7R7BB104)
C45  value 10uF  [CAPC0805(2012)145_L]  (hidden comment: CAP 10uF 10V 0805(2012))
C46  value 10uF  [CAPC0805(2012)145_L]  (hidden comment: CAP 10uF 10V 0805(2012))
C47  value 4.7uF  [CAPC0603(1608)100_L]  (hidden comment: CAP 4.7uF 10V 0603(1608))
C48  value 0.1uF  [CAPC1005]  (hidden comment: CC0402KRX7R7BB104)
C49  value 0.1uF  [CAPC1005]  (hidden comment: CC0402KRX7R7BB104)
C50  value 10uF  [CAPC0805(2012)145_L]  (hidden comment: CAP 10uF 10V 0805(2012))
C51  value 10uF  [CAPC0805(2012)145_L]  (hidden comment: CAP 10uF 10V 0805(2012))
C52  value 1uF  [CAPC0402(1005)60_L]  (hidden comment: CAP 1uF 10V 0402(1005))
C53  value 4.7uF  [CAPC0603(1608)100_L]  (hidden comment: CAP 4.7uF 10V 0603(1608))
C54  value 0.1uF  [CAPC1005]  (hidden comment: CC0402KRX7R7BB104)
C55  value 0.1uF  [CAPC1005]  (hidden comment: CC0402KRX7R7BB104)
C56  value 4.7uF  [CAPC0603(1608)100_L]  (hidden comment: CAP 4.7uF 10V 0603(1608))
C96  value 10uF  [CAPC0805(2012)145_L]  (hidden comment: CAP 10uF 10V 0805(2012))
D3  PMEG4010CPA,115  [SOT1061]
D4  PMEG4010CPA,115  [SOT1061]
D5  PRTR5V0U2X,215  [NXP-SOT143B-4_V]
DS1  LTST-C190KRKT  [LTST-C191KRKT_V]
L3  MI0603J601R-10  [LIRD-MI0603J601R-10_V]
L4  MI0603L221R-10  [LIRD-HZ0603C601R-10-2_V]
L5  MI0603L221R-10  [LIRD-HZ0603C601R-10-2_V]
P2  61300211121  [61300211121]
P3  61300211121  [61300211121]
P4  61300311121  [61300311121]
P5  ZX62D-B-5P8(30)  [ZX62D-B-5P8(30)]
P6  ZX62D-B-5P8(30)  [ZX62D-B-5P8(30)]
P22  FTSH-105-01-F-DV  [FTSH-105-01-L-DV-K]
R25  Jumper  value 0 Ohm  [RESC0402(1005)_L]
R26  Jumper  value 0 Ohm  [RESC0402(1005)_L]
R27  value 470 Ohm  [RESC0402(1005)_L]  (hidden comment: 470R 5% 0402(1005))
R28  value 0 Ohm  [RESC0402(1005)_L]  (hidden comment: Jumper 0402(1005))
R29  12K1 1% 0402(1005)  value 12100 Ohm  [RESC0402(1005)_L]
R30  value 12100 Ohm  [RESC0402(1005)_L]  (hidden comment: 12K1 1% 0402(1005))
R31  value 12100 Ohm  [RESC0402(1005)_L]  (hidden comment: 12K1 1% 0402(1005))
R32  value 2200 Ohm  [RESC0402(1005)_L]  (hidden comment: 2K2 1% 0402(1005))
R33  value 12100 Ohm  [RESC0402(1005)_L]  (hidden comment: 12K1 1% 0402(1005))
R34  ERJ-2RKF1003X  value 100K Ohm  [RESC1005X40X25LL05T05]
R35  Jumper  value 0 Ohm  [RESC0402(1005)_L]
R37  value 2200 Ohm  [RESC0402(1005)_L]  (hidden comment: 2K2 1% 0402(1005))
R38  Jumper  value 0 Ohm  [RESC0402(1005)_L]
R40  Jumper  value 0 Ohm  [RESC0402(1005)_L]
R41  value 100K Ohm  [RESC1005X40X25LL05T05]  (hidden comment: ERJ-2RKF1003X)
R81  value 100K Ohm  [RESC1005X40X25LL05T05]  (hidden comment: ERJ-2RKF1003X)
R108  value 100K Ohm  [RESC1005X40X25LL05T05]  (hidden comment: ERJ-2RKF1003X)
R122  value 100K Ohm  [RESC1005X40X25LL05T05]  (hidden comment: ERJ-2RKF1003X)
R127  Jumper  value 0 Ohm  [RESC0402(1005)_L]
TP1  TP 1mm  [SMT Test Point]  (value not drawn)  (no BOM)
TP2  TP 1mm  [SMT Test Point]  (value not drawn)  (no BOM)
TP3  TP 1mm  [SMT Test Point]  (value not drawn)  (no BOM)
TP4  TP 1mm  [SMT Test Point]  (value not drawn)  (no BOM)
TP5  TP 1mm  [SMT Test Point]  (value not drawn)  (no BOM)
TP6  TP 1mm  [SMT Test Point]  (value not drawn)  (no BOM)
TP7  TP 1mm  [SMT Test Point]  (value not drawn)  (no BOM)
TP8  TP 1mm  [SMT Test Point]  (value not drawn)  (no BOM)
TP9  TP 1mm  [SMT Test Point]  (value not drawn)  (no BOM)
TP11  TPAD 0.8mm  [TH Test Pad 0.8mm]  (value not drawn)  (no BOM)
TP12  TPAD 0.8mm  [TH Test Pad 0.8mm]  (value not drawn)  (no BOM)
TP13  TPAD 0.8mm  [TH Test Pad 0.8mm]  (value not drawn)  (no BOM)
TP14  TPAD 0.8mm  [TH Test Pad 0.8mm]  (value not drawn)  (no BOM)
TP15  TPAD 0.8mm  [TH Test Pad 0.8mm]  (value not drawn)  (no BOM)
TP16  TPAD 0.8mm  [TH Test Pad 0.8mm]  (value not drawn)  (no BOM)
TP17  TPAD 0.8mm  [TH Test Pad 0.8mm]  (value not drawn)  (no BOM)
TP18  TP 1mm  [SMT Test Point]  (value not drawn)  (no BOM)
U2  LPC4322JET100E  [BGA100_9x9x1.2mm]  (parts D,E of 5)
U8  XC6214P182PR-G  [SOT-89-3]
U9  XC6214P332PR-G  [SOT-89-3]
U10  XC6223H251MR-G  [SOT25]
Y1  value 12MHZ  [2-LEAD 11.4X4.8]  (hidden comment: ABLS2-12.000MHZ-D4Y-T)

### Nets
2.5V_LINK_CORE: C34.2 C35.1 C36.1 L3.2 TP1.1(TP) U2.E4(VDDREG) U2.E5(VDDREG) U2.F4(VDDREG)
+2.5V_LINK: C27.2 C28.2 C29.2 C30.1 C31.2 C37.1 C38.1 C39.1 C40.1 C55.1 C56.2 C96.2 L3.1 P22.1 R30.2 R31.1 R33.2 R34.1 R40.1 R81.2 R108.2 R122.2 TP9.1(TP) U2.B2(VDDA) U2.C5(VBAT) U2.D1(USB0_VDDA3V3_DRIVER) U2.D2(USB0_VDDA3V3) U2.F10(VDDIO) U2.K5(VDDIO)
+5V: C42.2 C43.1 C47.2 C48.1 D3.3(K) D4.3(K) TP4.1(TP) U8.2(VIN) U9.2(VIN)
+5V_EXT: C41.2 L4.1 P5.1(VCC)
+5V_LINK: C53.2 C54.1 D4.1(A1) D5.4(VCC) L5.2 R27.2 R41.1 TP7.1(TP) U10.1(VIN)
+5V_PWR_ONLY: D3.1(A1) L4.2 TP3.1(TP)
GND: C27.1 C28.1 C29.1 C30.2 C31.1 C32.1 C33.2 C34.1 C35.2 C36.2 C37.2 C38.2 C39.2 C40.2 C41.1 C42.1 C43.2 C44.2 C45.1 C46.1 C47.1 C48.2 C49.2 C50.1 C51.1 C52.1 C53.1 C54.2 C55.2 C56.1 C96.1 D5.1(GND) DS1.2(K) P2.1 P2.2 P3.1 P3.2 P5.5(GND) P5.6(SHLD) P6.5(GND) P6.6(SHLD) P22.3 P22.5 R29.2 R32.1 R127.1 TP2.1(TP) U2.C2(VSSA) U2.C8(VSS) U2.D3(USB0_VSSA_TERM) U2.D4(VSS) U2.D5(VSS) U2.F2(USB0_VSSA_REF) U2.G8(VSS) U2.J3(VSS) U2.J6(VSS) U8.1(GND) U9.1(GND) U10.2(GND)
USB_FS_VBUS_TRGT: D3.2(A2) TP6.1(TP)
USB_HS_VBUS_TRGT: D4.2(A2) TP8.1(TP)
VDD_TARGET: P4.2 R37.2
VDD_TARGET_1.8: C45.2 C46.2 P4.1 R35.1 TP5.1(TP)
VDD_TARGET_3.3: C50.2 C51.2 P4.3 R38.1 TP18.1(TP)
DBGEN: R31.2 TP12.1(TP) U2.A6(DBGEN)
FC1_I2C_SCL: R25.2
FC1_I2C_SDA: R26.2
~{RESET}_LINK2: P22.10 R33.1 TP13.1(TP) U2.B6(~{RESET})
SWDCLK_LINK2: P22.4 R32.2 TP14.1(TP) U2.H2(TCK/SWDCLK)
SWDIO_LINK2: P22.2 R81.1 TP15.1(TP) U2.C4(TMS/SWDIO)
SWO_LINK2: P22.6 R108.1 TP16.1(TP) U2.H3(TDO/SWO)
~{TRST}: R30.1 TP11.1(TP) U2.B4(~{TRST})
TDI_LINK2: P22.8 R122.1 TP17.1(TP) U2.G3(TDI)
USB0_RREF_LINK: R29.1 U2.F3(USB0_RREF)
USB_ID: P6.4(ID) R28.1
USB_LINK_D_N: D5.3(I/O2) P6.2(D-) U2.E2(USB0_DM)
USB_LINK_D_P: D5.2(I/O1) P6.3(D+) U2.E1(USB0_DP)
NetC32_2: C32.2 U2.B1(XTAL1) Y1.1(OSC1)
NetC33_1: C33.1 U2.C1(XTAL2) Y1.2
NetC44_1: C44.1 R35.2 U8.3(VOUT)
NetC49_1: C49.1 R38.2 U9.3(VOUT)
NetC52_2: C52.2 L5.1 P6.1(VCC)
NetDS1_1: DS1.1(A) R37.1
NetP22_9: P22.9 R127.2
NetR25_1: R25.1 U2.D6(I2C0_SCL)
NetR26_1: R26.1 U2.E6(I2C0_SDA)
NetR27_1: R27.1 U2.E3(USB0_VBUS)
NetR28_2: R28.2 U2.F1(USB0_ID)
NetR34_2: R34.2 U2.A4(WAKEUP0)
NetR40_2: R40.2 U10.5(VOUT)
NetR41_2: R41.2 U10.3(CE)

Not connected (* = marked no-connect by the designer): P5 2(D-) 3(D+) 4(ID); P22 7; U2 A1(ADC0_1/ADC1_1) A2(ADC0_0/ADC1_0/DAC) A3(ADC0_3/ADC1_3) A5(RTCX1) B3(ADC0_2/ADC1_2) B5(RTCX2) C3(RTC_ALARM) E9(USB1_DP) E10(USB1_DM) K3(CLK0/EMC_CLK0/CLKOUT/SD_CLK/EMC_CLK01/SSP1_SCK/ENET_TX_CLK_(ENET_REF_CLK)) K6(CLK2/EMC_CLK3/CLKOUT/SD_CLK/EMC_CLK23/I2S0_TX_MCLK/I2S1_RX_SCK); U10 4(NC)

### Layout directives
differential pair: USB_LINK_D_N, USB_LINK_D_P

### Notes on the sheet
- Ground TestPoints
- (near P5) Power only USB connector
- Debug probe USB connector
- (near P4) Power Source Selector
  VDD = 3.3v        Short 2 - 3
  VDD = 1.8v        Short 1 - 2
- Project:
- Sheet:
- Revision:
- Date:
- Size:
- Sheet number:
- Engineer
- Checked by:
- A3
- of
- www.code-ing.com

### Library data of the parts
C27 C28 C45 C46 C50 C51 C96 = CMP-1036-04922-1: CAP 10uF 10V ±10% 0805 (2012 Metric) Thickness 1.45mm SMD; Tolerance: Â±10%; Case-EIA: 0805; Case-Metric: 2012; Technology: SMT; Rated Voltage: 10 V; Max Thickness: 1.45 mm
C29 C34 C41 C42 C47 C53 C56 = CMP-1035-02785-1: CAP 4.7uF 10V ±10% 0603 (1608 Metric) Thickness 1mm SMD; Tolerance: Â±10%; Case-EIA: 0603; Case-Metric: 1608; Max Thickness: 1 mm; Technology: SMT; Rated Voltage: 10 V
C30 C35-C40 C43 C44 C48 C49 C54 C55 = CMP-0001-00074-1: Capacitor, Yageo, Ceramic, 0.1uF 10% 16V 0402 (1005) X7R; Polarity: Non-Polarized; ClassName: Board Template Device; Rated Voltage: 16 V; Status: Production; Tolerance: 10 %; Mounting Technology: Surface Mount; Technology: Ceramic; Category: Capacitor; Dielectric: X7R; Publisher: Altium
C31 = CMP-1034-01880-1: CAP 10nF 25V ±10% 0402 (1005 Metric) Thickness 0.6mm SMD; Tolerance: Â±10%; Case-Metric: 1005; Case-EIA: 0402; Technology: SMT; Max Thickness: 0.6 mm; Rated Voltage: 25 V
C32 C33 = CMP-1034-00963-1: CAP 27pF 50V ±5% 0402 (1005 Metric) Thickness 0.6mm SMD; Case-EIA: 0402; Case-Metric: 1005; Tolerance: Â±5%; Max Thickness: 0.6 mm; Rated Voltage: 50 V; Technology: SMT
C52 = CMP-1034-02118-1: CAP 1uF 10V -20% to +80% 0402 (1005 Metric) Thickness 0.6mm SMD; Case-EIA: 0402; Case-Metric: 1005; Tolerance: -20% to +80%; Max Thickness: 0.6 mm; Rated Voltage: 10 V; Technology: SMT
D3 D4 = PMEG4010CPA,115: DIODE ARRAY SCHOTTKY 40V 3HUSON; Manufacturer: Nexperia USA Inc.; Manufacturer part #: PMEG4010CPA,115; Created by: eteoflo; Creation date: 10-Apr-2018; Indications: *; Modified by: *; Value: *
D5 = CMP-2000-05285-1: Ultra Low Capacitance Double Rail-to-Rail ESD Protection Diode, 5.5 V, 1 pF, -40 to 85 degC, 4-Pin SOT143B, RoHS, Tape and Reel; Manufacturer: NXP Semiconductors; Capacitance Value: 16pF; Number of Elements: 1; Rad Hardened: No; Reverse Breakdown Voltage: 6V; Working Voltage (Max): 5.5V; Polarity: Uni-Directional; Configuration: Quad; Leakage Current: 0.1uA; Product Height (mm): 1mm; Suppressor Type: DiodeArrays; Product Length (mm): 3mm; Product Depth (mm): 1.4mm; ESD Protection Voltage: 8KV@ContactDisc; Package Type: SOT; Mounting: SurfaceMount; Packaging: TapeandReel; Datasheet Version: Rev. 02, 01/2008; Reverse Stand-off Voltage: 5.5V; Manufacturer URL: http://www.nxp.com/; Operating Temp Range: -40Cto85C; Operating Temperature Classification: Industrial; Working Voltage: 5.5V; Operating Temperature Min Deg. C: -40C; Datasheet URL: https://datasheet.ciiva.com/4479/prtr5v0u2x-102853-4479461.pdf; Leakage Current (Max): 0.1uA; Direction Type: Uni-Directional; Pin Count: 3+Tab; Operating Temperature Max Deg. C: 85C; Mounting Style: SurfaceMount; Package / Case: SOT
DS1 = CMP-1674-00011-1: LED Uni-Color Red, 62.5 mW, 5 V, -30 to 85 degC, 2-Pin SMD, RoHS, Tape and Reel; Capacitance: 100 uF; Voltage Rating: 50 V; Case\Package: Radial; Tolerance: 20%; Packaging: Bulk; REACH SVHC: No SVHC; ComponentLink1Description: Manufacturer URL; ComponentLink2URL: http://optoelectronics.liteon.com/upload/download/DS-22-99-0151/S_110_LTST-C190KRKT.pdf; Max Operating Temperature: 85 degC; DatasheetVersion: Rev. F, 05/2013; Pins: 2; Voltage Rating (DC): 50 V; Mount: Through Hole; Lead Pitch: 3.5 mm; Diameter: 8 mm; ComponentLink1URL: http://www.us.liteon.com/; Radiation Hardening: No; Package Quantity: 200; PackageReference: C191KRKT; RoHSCompliant: true; Height: 11.5 mm; PackageDescription: 2-Pin Surface Mount Device, Body 1.6 x 0.8 mm; Length: 11.5 mm; ComponentLink2Description: Datasheet; Min Operating Temperature: -40 degC
L3 = CMP-2000-06700-1: Ferrite Bead, 600 Ohm, 1 A, -40 to 125 degC, 2-Pin SMD, RoHS, Tape and Reel; Manufacturer: Laird; DC Resistance (DCR) (Max): 200mOhm; Online Catalog: MISeries; Number of Lines: 1; Kits: 240-2227-ND-KITEMIFERRITEBEADCHIPSMD; Other Names: 240-2371-1; Impedance @ Frequency: 600Ohm@100MHz; Filter Type: PowerLine; Current Rating (Max): 1A; Catalog Drawings: (HI,HZ,LI,MI)0603Series_0.95mmMax.Height; Datasheet Version: Rev. C, 08/2013; Ratings: -; Package Description: 2-Pin Surface Mount Device, Body 1.6 x 0.8 mm; Operating Temperature: -40°C~125°C; Category: Filters; Mounting Type: SurfaceMount; Size / Dimension: 0.063"Lx0.031"W(1.60mmx0.80mm); Family: FerriteBeadsandChips; Package Reference: MI00603J601R-10; Manufacturer URL: https://www.lairdtech.com/; Height (Max): 0.037"(0.95mm); Series: MI; Packaging: CutTape(CT); Mounting Technology: SurfaceMount; Package / Case: 0603(1608Metric); Standard Package: 1; Datasheet URL: http://cdn.lairdtech.com/home/brandworld/files/MI0603J601R-10.pdf
L4 L5 = CMP-2000-06701-1: Chip Bead, 100 MHz, 2 A, -40 to 125 degC, 2-Pin SMD (0603), RoHS, Tape and Reel; Case Height: 0.5mm; Impedance: 220Ohms; Maximum DC Resistance: 80mOhms; Brand: LairdTechnologies; Case Length: 1.6mm; Maximum DC Current: 2A; Unit Weight: 0.000192oz; Test Frequency: 100MHz; Package Description: 2-Pin Surface Mount Device, Body 1.6 x 0.8 mm; Datasheet URL: http://cdn.lairdtech.com/home/brandworld/files/MI0603L221R-10.pdf; Package Reference: 0603; Factory Pack Quantity: 4000; Mounting Technology: SurfaceMount; Packaging: Reel; Case Width: 0.5mm; Operating Temperature Range: -40Cto+125C; Dimensions: 0.5mmWx1.6mmLx0.5mmH; Package / Case: 0603(1608metric); Product Category: EMIFilterBeads,Chips&Arrays; Series: MI; Manufacturer URL: https://www.lairdtech.com/; Termination Style: SMD/SMT; Manufacturer: LairdTechnologies; Product: FerriteChipBeads; Datasheet Version: Rev. E, 08/2013; RoHS: Details
P2 P3 = 61300211121: HEADER 2POS SNGL T/H 2.54MM; Manufacturer: Wurth Electronics Inc; Indications: DNI; Manufacturer part #: 61300211121; Modified by: *; Value: *; Created by: gmoreno; Creation date: 28-Jul-2012
P4 = 61300311121: HEADER 3POS SNGL T/H 2.54MM; Manufacturer: Wurth Electronics Inc; Manufacturer part #: 61300311121; DigiKey: *; Indications: *; Modified by: *; Value: *; Created by: gmoreno; Creation date: 28-Jul-2012
P5 P6 = ZX62D-B-5P8(30): CONN RCPT USB MICRO B SMD; Manufacturer: Hirose Electric Co Ltd; Manufacturer part #: ZX62D-B-5P8(30); Created by: eteofilo; Creation date: 09-Apr-2018; Modified by: *; Value: *; Indications: *
P22 = FTSH-105-01-F-DV: CONN HEADER 10POS DUAL .05" SMD; Manufacturer: Samtec Inc; Indications: DNI; Manufacturer part #: FTSH-105-01-F-DV; Created by: gmoreno; Creation date: 29-Jul-2013; Value: *; Modified by: *
R25 R26 R28 R35 R38 R40 R127 = CMP-1011-00001-1: Jumper 0402 (1005 Metric); Tolerance: None; Case-Metric: 1005; Case-EIA: 0402; Power: None; Technology: SMT
R27 = CMP-1011-00066-1: 470R 0.063W 5% 0402 (1005 Metric)  SMD; Case-EIA: 0402; Case-Metric: 1005; Technology: SMT; Tolerance: 5 %; Power: 0.063 W
R29-R31 R33 = CMP-1011-00632-1: 12K1 0.063W 1% 0402 (1005 Metric)  SMD; Case-EIA: 0402; Case-Metric: 1005; Power: 0.063 W; Tolerance: 1 %; Technology: SMT
R32 R37 = CMP-1011-00546-1: 2K2 0.063W 1% 0402 (1005 Metric)  SMD; Case-Metric: 1005; Case-EIA: 0402; Power: 0.063 W; Tolerance: 1 %; Technology: SMT
R34 R41 R81 R108 R122 = CMP-2002-00608-3: Chip Resistor, 100 KOhm, +/- 1%, 100 mW, -55 to 155 degC, 0402 (1005 Metric), RoHS, Tape and Reel; Manufacturer: Basic Passives; Power Rating: 100 mW; Voltage Rating: 50 V; Case\/Package: 0402; Case Code (Imperial): 0402; RoHSCompliant: true; Min Operating Temperature: -55 degC; Mount: Surface Mount; Packaging: Tape and Reel; PackageDescription: 2-Pin Surface Mount Device, Body 1 x 0.5 mm; Tolerance: 1%; REACH SVHC: Yes; ComponentLink1URL: http://www.panasonic.com/; ComponentLink1Description: Manufacturer URL; Package Quantity: 10000; Mounting Technology: Surface Mount; DatasheetVersion: 04/2015; PartNumber: ERJ-2RKF1003X; Height: 0.35 mm; Pins: 2; Length: 1 mm; Max Operating Temperature: 155 degC; ComponentLink2Description: Datasheet; ComponentLink2URL: http://industrial.panasonic.com/cdbs/www-data/pdf/RDA0000/AOA0000C86.pdf; PackageReference: 0402; Radiation Hardening: No; Width: 0.5 mm; Case Code (Metric): 1005
TP1-TP9 TP18 = TP 1mm: PCB TEST POINT SMT 1mm; Manufacturer part #: *; DigiKey: *; Indications: *; Value: *; Modified by: *; Manufacturer: *; Created by: gmoreno; Creation date: 26-Apr-2012
TP11-TP17 = TP 0.8mm: PCB TEST PAD TH 0.8mm; Manufacturer part #: *; DigiKey: *; Indications: *; Value: *; Modified by: *; Manufacturer: *; Created by: eteofilo; Creation date: 22-Feb-2018
U2 = LPC4322JET100E: IC MCU 32BIT 512KB FLASH 100BGA; Manufacturer: NXP; Manufacturer Part #: LPC4322JET100E; Created by: eteofilo; Creation Date: 09-Apr-2018; Modified by: *; Indications: *; Value: *
U8 = XC6214P182PR-G: IC REG LDO 1.8V 0.5A SOT89-3; Manufacturer: Torex Semiconductor Ltd; Indications: *; Created by: eteofilo; Creation date: 30-May-2018; Manufacturer part #: XC6214P182PR-G; Modified by: *; Value: *
U9 = XC6214P332PR-G: IC REG LDO 3.3V 0.5A SOT89-3; Manufacturer: Torex Semiconductor Ltd; Indications: *; Created by: eteofilo; Creation date: 30-May-2018; Manufacturer part #: XC6214P332PR-G; Modified by: *; Value: *
U10 = XC6223H251MR-G: IC REG LINEAR 2.5V SOT25-5; Manufacturer: Torex Semiconductor; Manufacturer part #: XC6223H251MR-G; Modified by: *; Indications: *; Value: *; Created by: eteofilo; Creation date: 30-May-2018
Y1 = ABLS2-12.000MHZ-D4Y-T: CRYSTAL 12.0000MHZ 18PF SMD; Manufacturer: Abracon LLC; Manufacturer part #: ABLS2-12.000MHZ-D4Y-T; Indications: *; Modified by: *; Created by: eteofilo; Creation date: 06-Jul-2017

## Nets that join several sheets
+2.5V_LINK: BRIDGE-ACCELEROMETER (7 pins), LINK2_LPC4322 PERIPH-DEBUG (8 pins), LINK2_LPC4322-USB-BRPWR (29 pins)
+5V: SHIELD-uSD-MIKROE-PMOD (P16.14 R97.1 R111.1), LINK2_LPC4322-USB-BRPWR (9 pins)
+5V_EXT: LPCXpresso55SXX_POWER-USB (U19.1), LINK2_LPC4322-USB-BRPWR (C41.2 L4.1 P5.1)
GND: LPCXpresso55SXX_POWER-USB (58 pins), LPCXpresso55SXX_MCU (10 pins), SHIELD-uSD-MIKROE-PMOD (16 pins), BRIDGE-ACCELEROMETER (17 pins), CODEC (27 pins), LINK2_LPC4322 PERIPH-DEBUG (31 pins), LINK2_LPC4322-USB-BRPWR (59 pins)
USB_FS_VBUS_TRGT: LPCXpresso55SXX_POWER-USB (L7.2 R86.1), LINK2_LPC4322-USB-BRPWR (D3.2 TP6.1)
USB_HS_VBUS_TRGT: LPCXpresso55SXX_POWER-USB (L6.2 R82.1), LINK2_LPC4322-USB-BRPWR (D4.2 TP8.1)
VDD_TARGET: LPCXpresso55SXX_POWER-USB (6 pins), LPCXpresso55SXX_MCU (16 pins), SHIELD-uSD-MIKROE-PMOD (11 pins), BRIDGE-ACCELEROMETER (5 pins), CODEC (R12.2), LINK2_LPC4322 PERIPH-DEBUG (D6.2 J3.1 R63.2 U14.14), LINK2_LPC4322-USB-BRPWR (P4.2 R37.2)
VDD_TARGET_1.8: CODEC (5 pins), LINK2_LPC4322-USB-BRPWR (5 pins)
VDD_TARGET_3.3: LPCXpresso55SXX_POWER-USB (U1.38 U1.96), LINK2_LPC4322-USB-BRPWR (5 pins)
ADC0_N: LPCXpresso55SXX_MCU (R39.1 U1.14), SHIELD-uSD-MIKROE-PMOD (P19.2 P23.1)
ADC0_P: LPCXpresso55SXX_MCU (R83.1 U1.20), SHIELD-uSD-MIKROE-PMOD (P19.4)
BRDG_INTR-ISP_DIR: BRIDGE-ACCELEROMETER (R6.2 U3.10), LINK2_LPC4322 PERIPH-DEBUG (U2.J7)
BRIDGE_L_INTR-ISP: BRIDGE-ACCELEROMETER (R9.2), LINK2_LPC4322 PERIPH-DEBUG (U2.J5)
BRIDGE_L_MISO: BRIDGE-ACCELEROMETER (U6.6), LINK2_LPC4322 PERIPH-DEBUG (U2.J1)
BRIDGE_L_MOSI: BRIDGE-ACCELEROMETER (U3.6), LINK2_LPC4322 PERIPH-DEBUG (U2.J2)
BRIDGE_L_SCK: BRIDGE-ACCELEROMETER (U3.4), LINK2_LPC4322 PERIPH-DEBUG (U2.K9)
BRIDGE_L_SSEL: BRIDGE-ACCELEROMETER (U3.3), LINK2_LPC4322 PERIPH-DEBUG (U2.K10)
BRIDGE_UART_RXD: BRIDGE-ACCELEROMETER (U6.4), LINK2_LPC4322 PERIPH-DEBUG (U2.G10)
BRIDGE_UART_TXD: BRIDGE-ACCELEROMETER (U6.5), LINK2_LPC4322 PERIPH-DEBUG (U2.G7)
COMPARATOR: LPCXpresso55SXX_MCU (U1.54), SHIELD-uSD-MIKROE-PMOD (P19.6)
FC0_USART_RXD: LPCXpresso55SXX_MCU (P8.2 U1.92), BRIDGE-ACCELEROMETER (R1.2)
FC0_USART_TXD: LPCXpresso55SXX_MCU (P8.3 U1.94), BRIDGE-ACCELEROMETER (U6.12)
FC1_I2C_SCL: LPCXpresso55SXX_MCU (R72.1 U1.72), SHIELD-uSD-MIKROE-PMOD (P19.11 P19.12 R104.2), LINK2_LPC4322-USB-BRPWR (R25.2)
FC1_I2C_SDA: LPCXpresso55SXX_MCU (R71.1 U1.71), SHIELD-uSD-MIKROE-PMOD (P19.9 P19.10 R106.2), LINK2_LPC4322-USB-BRPWR (R26.2)
FC2_USART_TXD_ARD: LPCXpresso55SXX_MCU (U1.27), SHIELD-uSD-MIKROE-PMOD (P18.13 P24.4)
FC3_SPI_MISO: LPCXpresso55SXX_MCU (R117.1 U1.81), SHIELD-uSD-MIKROE-PMOD (R103.1), BRIDGE-ACCELEROMETER (U6.11)
FC3_SPI_MOSI: LPCXpresso55SXX_MCU (R118.1 U1.83), SHIELD-uSD-MIKROE-PMOD (R101.1), BRIDGE-ACCELEROMETER (U3.11)
FC3_SPI_SCK: LPCXpresso55SXX_MCU (U1.89), SHIELD-uSD-MIKROE-PMOD (R105.1), BRIDGE-ACCELEROMETER (U3.13)
FC3_SPI_SSEL0: LPCXpresso55SXX_MCU (R119.1 U1.86), SHIELD-uSD-MIKROE-PMOD (R99.1), BRIDGE-ACCELEROMETER (U3.14)
FC4_I2C_SCL_ARD: LPCXpresso55SXX_MCU (R120.1 U1.4), SHIELD-uSD-MIKROE-PMOD (P17.1 P24.5), BRIDGE-ACCELEROMETER (R3.2), CODEC (R14.2)
FC4_I2C_SDA_ARD: LPCXpresso55SXX_MCU (R121.1 U1.30), SHIELD-uSD-MIKROE-PMOD (P17.3 P24.6), BRIDGE-ACCELEROMETER (R4.2), CODEC (R15.2)
FC6_I2S_RX: LPCXpresso55SXX_MCU (U1.2), SHIELD-uSD-MIKROE-PMOD (P17.20), CODEC (R109.2)
FC7_I2S_SCK: LPCXpresso55SXX_MCU (U1.76), SHIELD-uSD-MIKROE-PMOD (P17.14), CODEC (R18.2)
FC7_I2S_TX: LPCXpresso55SXX_MCU (U1.74), SHIELD-uSD-MIKROE-PMOD (P17.10), CODEC (R21.2)
FC7_I2S_WS: LPCXpresso55SXX_MCU (U1.90), SHIELD-uSD-MIKROE-PMOD (P17.12), CODEC (R19.2)
IF_SWDIO: LPCXpresso55SXX_MCU (R123.1 U1.12), LINK2_LPC4322 PERIPH-DEBUG (D7.5 P7.2 R60.2)
LEDB/PWM_ARD: LPCXpresso55SXX_MCU (R78.1 U1.1), SHIELD-uSD-MIKROE-PMOD (P18.5)
LEDG/PWM_ARD: LPCXpresso55SXX_MCU (R79.1 U1.9), SHIELD-uSD-MIKROE-PMOD (P18.7)
LEDR/PWM_ARD: LPCXpresso55SXX_MCU (R80.1 U1.5), SHIELD-uSD-MIKROE-PMOD (P18.9)
LSPI_HS_MISO: LPCXpresso55SXX_MCU (R115.1 U1.62), SHIELD-uSD-MIKROE-PMOD (P17.11 P23.5)
LSPI_HS_MOSI: LPCXpresso55SXX_MCU (R116.1 U1.60), SHIELD-uSD-MIKROE-PMOD (P17.13 P23.6)
LSPI_HS_SCK: LPCXpresso55SXX_MCU (U1.61), SHIELD-uSD-MIKROE-PMOD (P17.9 P23.4)
LSPI_HS_SSEL1: LPCXpresso55SXX_MCU (R114.1 U1.59), SHIELD-uSD-MIKROE-PMOD (P17.15 P23.3)
P0_5-ISP1: LPCXpresso55SXX_MCU (J10.1 R124.2 S1.1 U1.88), SHIELD-uSD-MIKROE-PMOD (P17.8), BRIDGE-ACCELEROMETER (R8.1), LINK2_LPC4322 PERIPH-DEBUG (P7.7 R51.2)
PIO0_15_GPIO_ARD: LPCXpresso55SXX_MCU (U1.22), SHIELD-uSD-MIKROE-PMOD (P18.11)
PIO0_18_GPIO_ARD: LPCXpresso55SXX_MCU (U1.56), SHIELD-uSD-MIKROE-PMOD (P18.20)
PIO1_5_GPIO_ARD: LPCXpresso55SXX_MCU (U1.31), SHIELD-uSD-MIKROE-PMOD (P17.17 P24.1)
PIO1_8_GPIO_ARD: LPCXpresso55SXX_MCU (U1.24), SHIELD-uSD-MIKROE-PMOD (P17.19)
PIO1_9_GPIO_ARD: LPCXpresso55SXX_MCU (R75.1 R77.2 U1.10), SHIELD-uSD-MIKROE-PMOD (P18.1)
PIO1_10_GPIO_ARD: LPCXpresso55SXX_MCU (U1.40), SHIELD-uSD-MIKROE-PMOD (P18.3)
PIO1_11_GPIO_ARD: LPCXpresso55SXX_MCU (U1.93), SHIELD-uSD-MIKROE-PMOD (P17.6)
PLU_CLKIN/GPIO/SD1_D0: LPCXpresso55SXX_MCU (U1.77), SHIELD-uSD-MIKROE-PMOD (P18.6)
PLU_IN0/GPIO: LPCXpresso55SXX_MCU (U1.91), SHIELD-uSD-MIKROE-PMOD (P19.7 P19.8), CODEC (R22.2)
PLU_IN3/GPIO: LPCXpresso55SXX_MCU (U1.73), SHIELD-uSD-MIKROE-PMOD (P17.18 R100.2)
PLU_IN4/GPIO: LPCXpresso55SXX_MCU (U1.85), SHIELD-uSD-MIKROE-PMOD (P17.16), CODEC (R24.2)
PLU_IN5/GPIO/SD1_WP: LPCXpresso55SXX_MCU (U1.68), SHIELD-uSD-MIKROE-PMOD (P18.18)
PLU_OUT1/GPIO: LPCXpresso55SXX_MCU (U1.58), SHIELD-uSD-MIKROE-PMOD (P18.14), BRIDGE-ACCELEROMETER (R5.2)
PLU_OUT4/GPIO: LPCXpresso55SXX_MCU (U1.41), SHIELD-uSD-MIKROE-PMOD (R102.2)
PLU_OUT5/GPIO/SD1_D3/FC4_SPI_SSEL2: LPCXpresso55SXX_MCU (U1.42), SHIELD-uSD-MIKROE-PMOD (P18.8)
PLU_OUT6/GPIO/FC2_USART_RXD_ARD/SD1_D1: LPCXpresso55SXX_MCU (U1.3), SHIELD-uSD-MIKROE-PMOD (P18.10 P18.15 P24.3)
~{RESET_ULP}: LPCXpresso55SXX_POWER-USB (6 pins), SHIELD-uSD-MIKROE-PMOD (P16.10 P23.2), LINK2_LPC4322 PERIPH-DEBUG (U14.8)
~{SD0_CARD_DET}: LPCXpresso55SXX_MCU (U1.8), SHIELD-uSD-MIKROE-PMOD (R107.8 U20.6)
~{SD1_CARD_DET}: LPCXpresso55SXX_MCU (U1.43), SHIELD-uSD-MIKROE-PMOD (P18.19)
SD0_CLK: LPCXpresso55SXX_MCU (U1.6), SHIELD-uSD-MIKROE-PMOD (R107.1 U20.4)
SD0_CMD: LPCXpresso55SXX_MCU (U1.26), SHIELD-uSD-MIKROE-PMOD (R107.2 U20.3)
SD0_D0: LPCXpresso55SXX_MCU (U1.70), SHIELD-uSD-MIKROE-PMOD (R107.6 U20.7)
SD0_D1: LPCXpresso55SXX_MCU (U1.79), SHIELD-uSD-MIKROE-PMOD (R107.5 U20.8)
SD0_D2: LPCXpresso55SXX_MCU (U1.23), SHIELD-uSD-MIKROE-PMOD (R107.4 U20.1)
SD0_D3: LPCXpresso55SXX_MCU (U1.11), SHIELD-uSD-MIKROE-PMOD (R107.3 U20.2)
SD0_PWR_EN: LPCXpresso55SXX_MCU (U1.55), SHIELD-uSD-MIKROE-PMOD (Q3.1)
SD1_CLK: LPCXpresso55SXX_MCU (U1.7), SHIELD-uSD-MIKROE-PMOD (P18.2)
SD1_CMD: LPCXpresso55SXX_MCU (U1.57), SHIELD-uSD-MIKROE-PMOD (P18.4)
SD1_D2: LPCXpresso55SXX_MCU (U1.82), SHIELD-uSD-MIKROE-PMOD (P18.12)
SD1_PWR_EN: LPCXpresso55SXX_MCU (U1.87), SHIELD-uSD-MIKROE-PMOD (P18.17)
SWDCLK_TRGT: LPCXpresso55SXX_MCU (R112.2 U1.13), LINK2_LPC4322 PERIPH-DEBUG (U14.4)
SWO_TRGT: LPCXpresso55SXX_MCU (R113.1 U1.21), LINK2_LPC4322 PERIPH-DEBUG (U14.12)
~{USB0_OVERCURRENT}: LPCXpresso55SXX_POWER-USB (U18.3), LPCXpresso55SXX_MCU (U1.66)
~{USB0_PORTPWR}: LPCXpresso55SXX_POWER-USB (U18.1), LPCXpresso55SXX_MCU (U1.67)
~{USB1_OVERCURRENT}: LPCXpresso55SXX_POWER-USB (U18.4), LPCXpresso55SXX_MCU (U1.65)
~{USB1_PORTPWR}: LPCXpresso55SXX_POWER-USB (U18.2), LPCXpresso55SXX_MCU (U1.80)
USB0_VBUS: LPCXpresso55SXX_POWER-USB (R86.2 R87.2), LPCXpresso55SXX_MCU (U1.78)
WAKE/GPIO: LPCXpresso55SXX_MCU (R74.1 R76.2 U1.64), SHIELD-uSD-MIKROE-PMOD (P18.16 P24.2)

## Assembly variants
LPC55S69: not fitted J5 J11 J12 P2 P3 P11 P12 P13 P14 P15 P22 P25 P26 P27 P28 P29 R36 R43 R44 R45 R62 R64 R65 R68 R70 R73 R114 R128; alternate parts U1 -> LPC55S69JBD100
LPC55S28: not fitted J5 J11 J12 P2 P3 P11 P12 P13 P14 P15 P22 P25 P26 P27 P28 P29 R36 R43 R44 R45 R62 R64 R65 R68 R70 R73 R114 R128; alternate parts U1 -> LPC55S28JBD100